# EasyEDA Pro project 基于ESP32的智慧种植小助手2.0_2024-08-18.epro

# Schematic Schematic1
Create Date: 2024-08-18; Page Name: P1; Project Name: 基于ESP32的智慧种植小助手2.0; Schematic Name: Schematic1; Update Date: 2024-08-18; Company: 嘉立创EDA; Page Size: A4; Version: V1.0
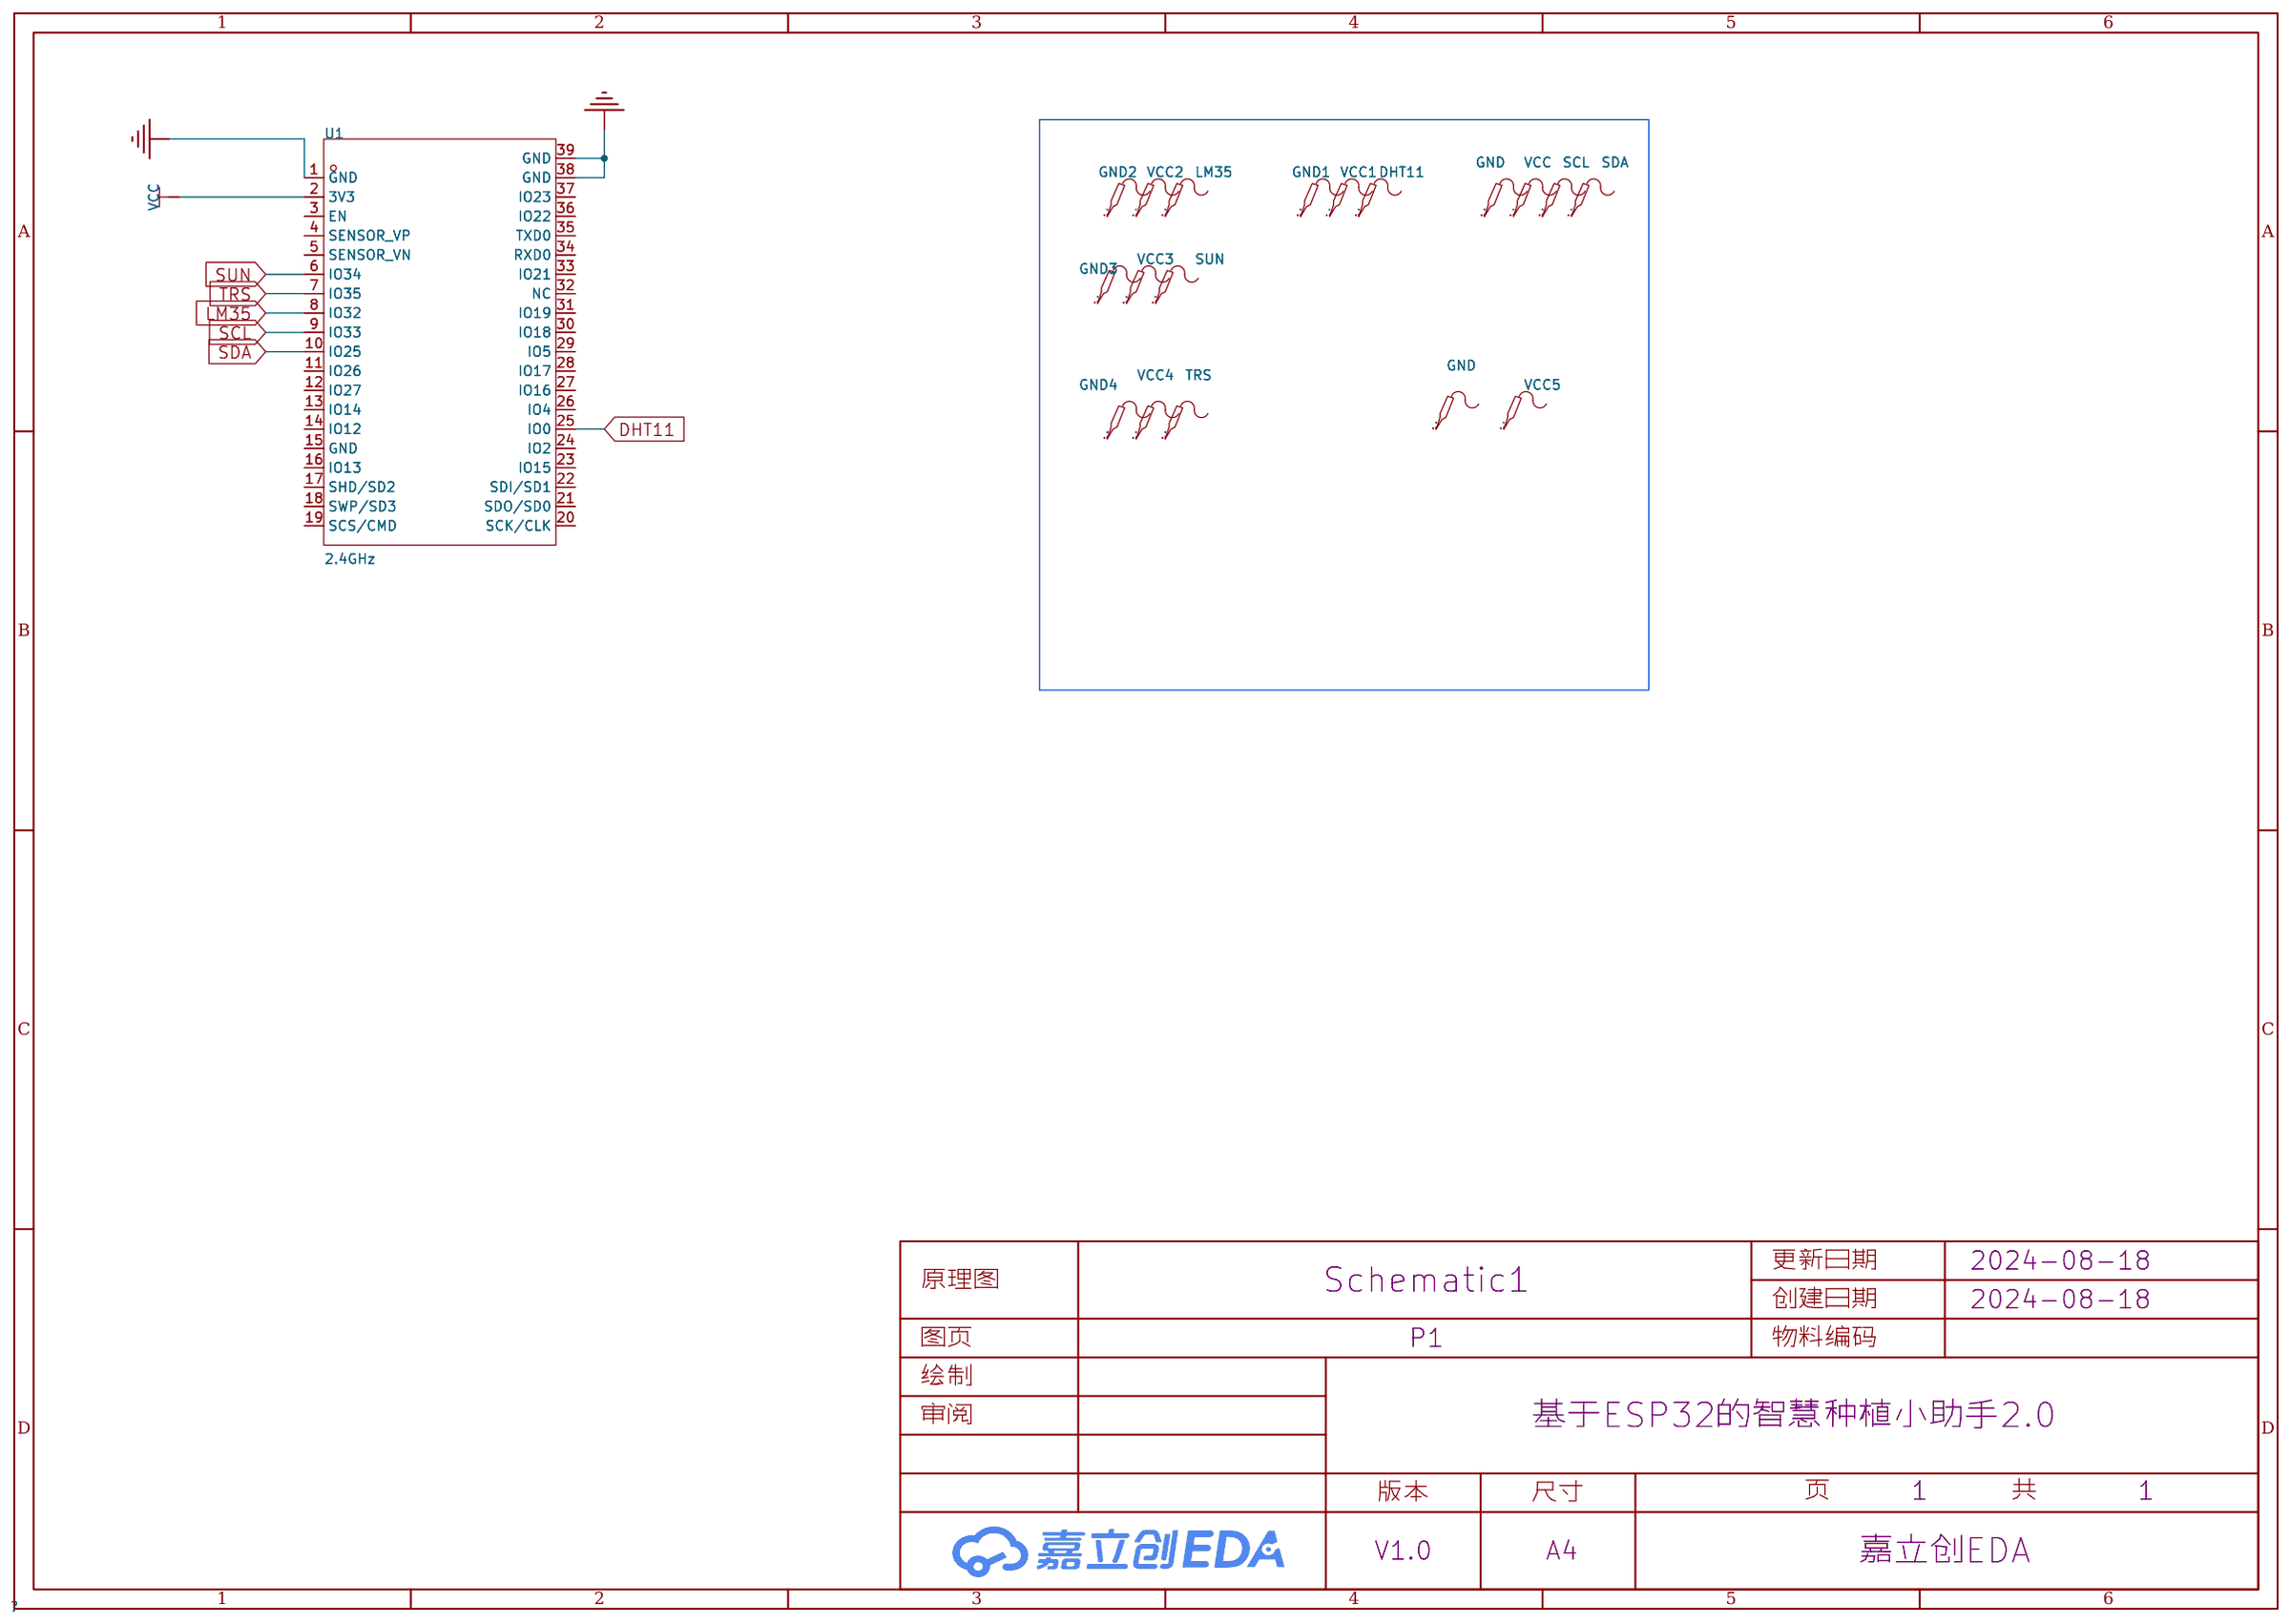
[diagram p0: schematic sheet]

## Parts
DHT11  -  [Test-Point-0.5mm]
GND  -  [Test-Point-0.5mm]
GND1  -  [Test-Point-0.5mm]
GND2  -  [Test-Point-0.5mm]
GND3  -  [Test-Point-0.5mm]
GND4  -  [Test-Point-0.5mm]
LM35  -  [Test-Point-0.5mm]
SCL  -  [Test-Point-0.5mm]
SDA  -  [Test-Point-0.5mm]
SUN  -  [Test-Point-0.5mm]
TP1  GND  [Test-Point-0.5mm]
TRS  -  [Test-Point-0.5mm]
U1  2.4GHz  [WIFIM-SMD_39P-L25.5-W18.0-P1.27]
VCC  -  [Test-Point-0.5mm]
VCC1  -  [Test-Point-0.5mm]
VCC2  -  [Test-Point-0.5mm]
VCC3  -  [Test-Point-0.5mm]
VCC4  -  [Test-Point-0.5mm]
VCC5  -  [Test-Point-0.5mm]

## Library data of the parts
DHT11 GND GND1-GND4 LM35 SCL SDA SUN TP1 TRS VCC VCC1-VCC5 = Test-Point: Test Point 测试点
U1 = ESP32-WROOM-32D(M113DH3200PH3Q0): 核心处理器:ESP32-D0WD芯片;频率:2.4GHz;发射功率:18.5dBm;; Supplier Part: C6244705; Manufacturer: ESPRESSIF(乐鑫); Supplier Footprint: SMD-38P; JLCPCB Part Class: 扩展库; Datasheet: https://atta.szlcsc.com/upload/public/pdf/source/20230606/9D9041236510235E53789CA7484217CB.pdf; Supplier: LCSC; Core Processor: ESP32-D0WD芯片; Support Interface: I2C；GPIO；SPI；JTAG；SDIO；ADC；UART；I2S; Output Power: 18.5dBm

## Nets
GND: U1.1(GND) U1.38(GND) U1.39(GND)
VCC: U1.2(3V3)
DHT11: U1.25(IO0)
LM35: U1.8(IO32)
SCL: U1.9(IO33)
SDA: U1.10(IO25)
SUN: U1.6(IO34)
TRS: U1.7(IO35)

Not connected (* = marked no-connect by the designer): DHT11 1; GND 1; GND1 1; GND2 1; GND3 1; GND4 1; LM35 1; SCL 1; SDA 1; SUN 1; TP1 1; TRS 1; U1 3(EN) 4(SENSOR_VP) 5(SENSOR_VN) 11(IO26) 12(IO27) 13(IO14) 14(IO12) 15(GND) 16(IO13) 17(SHD/SD2) 18(SWP/SD3) 19(SCS/CMD) 20(SCK/CLK) 21(SDO/SD0) 22(SDI/SD1) 23(IO15) 24(IO2) 26(IO4) 27(IO16) 28(IO17) 29(IO5) 30(IO18) 31(IO19) 32(NC) 33(IO21) 34(RXD0) 35(TXD0) 36(IO22) 37(IO23); VCC 1; VCC1 1; VCC2 1; VCC3 1; VCC4 1; VCC5 1

# Board PCB1
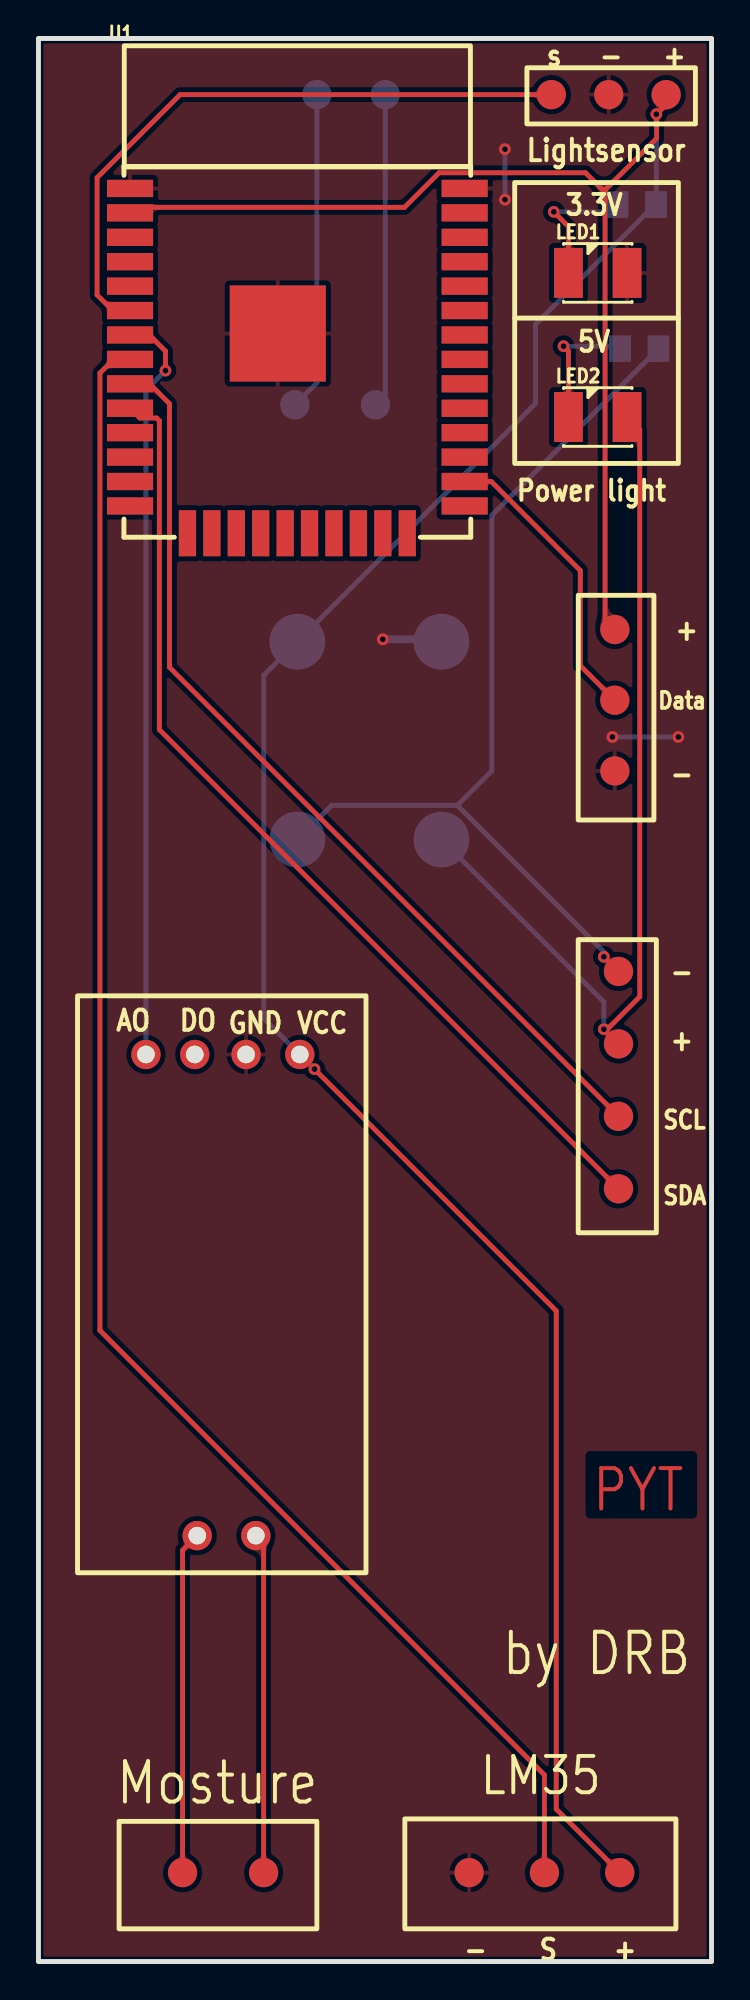
[diagram p1: board, top side]
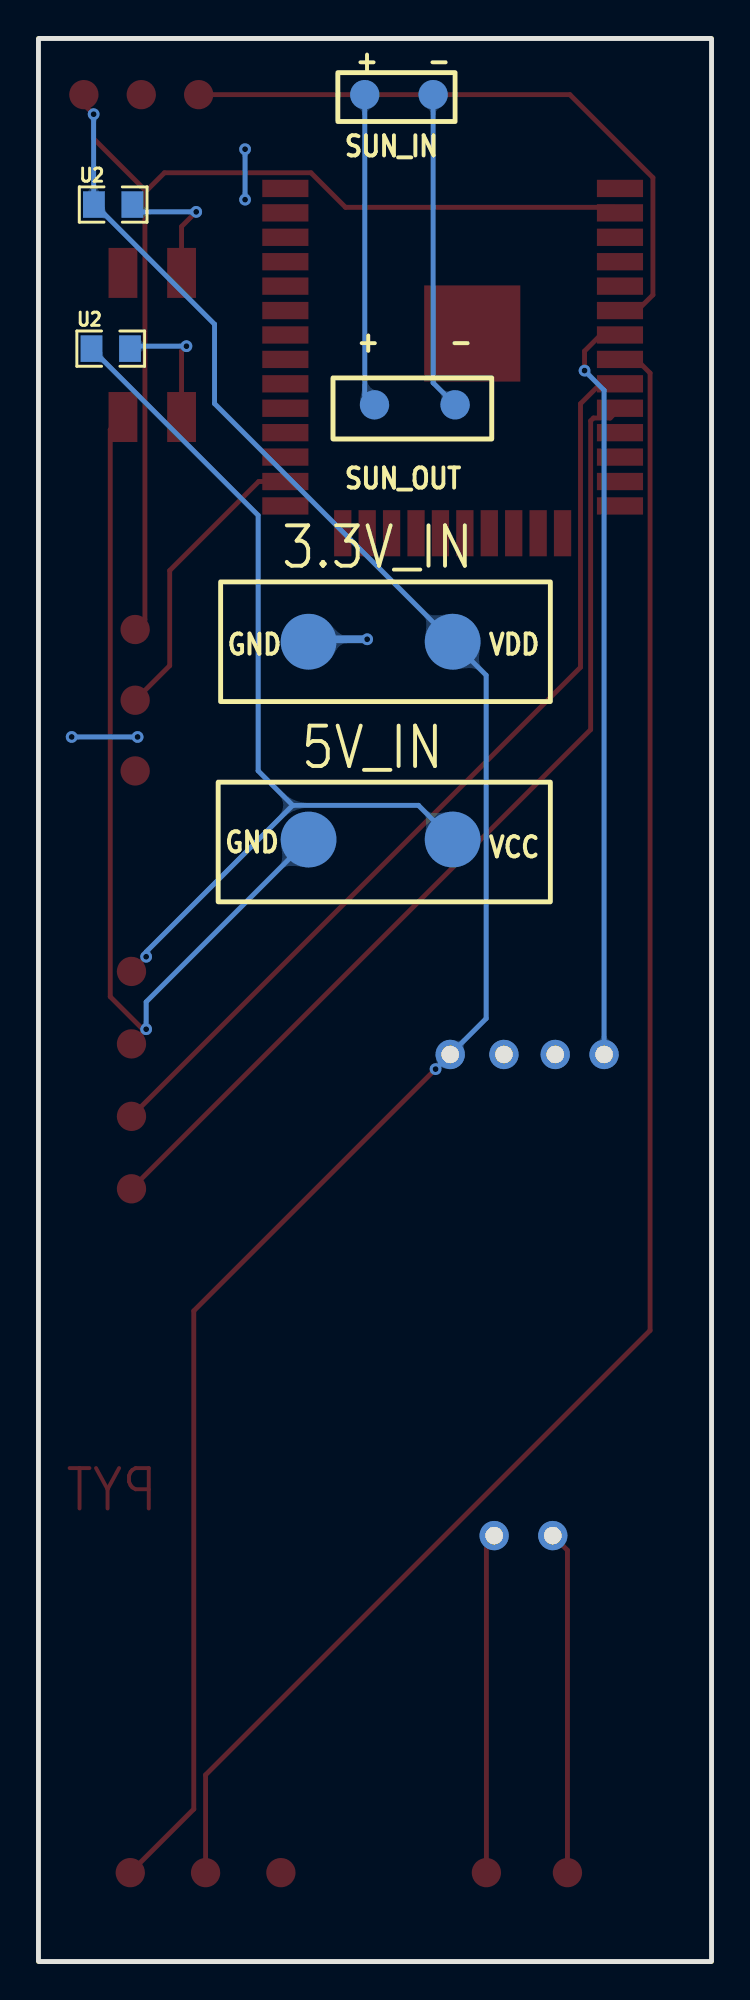
[diagram p2: board, bottom side, seen from below]

Outline 35 x 100 mm; copper layers: Top Layer, Bottom Layer. Coordinates in mm from the lower left corner of the outline.
Outline path: rectangle 0,100 35,0
Stack: Top Layer 0.035mm / Dielectric1 1.51mm FR4 er 4.5 / Bottom Layer 0.035mm

## Design rules (mm)
template: JLCPCB Capability(Two Layers Board)
spacing copperThickness1oz (default): track to track 0.102, other pairs 0.152 to 0.3
spacing copperThickness2oz: track to track 0.203, other pairs 0.152 to 0.3
track width copperThickness1oz (default): min 0.127, default 0.254, max 2.54
track width copperThickness2oz: min 0.203, default 0.254, max 2.54
differential pair differentialPair (default): width min 0.127, default 0.254, max 2.54; gap min 0.152, default 0.152
via viaSize (default): diameter min 0.5, default 0.61, max 10; hole min 0.3, default 0.305, max 6.3

## Placement (name value [footprint] x y rotation side)
LED1  D3528-LED-GREEN  [LED-SMD_L3.5-W2.8-RD_GREEN]  29.08 87.81 0 top
LED2  D3528-LED-GREEN  [LED-SMD_L3.5-W2.8-RD_GREEN]  29.08 80.31 0 top
NOREF  -  [Pad_e88]  30.16 43.95 0 top
NOREF#2  -  [Pad_e75]  8.13 47.17 0 top
NOREF#3  -  [Pad_e242]  13.34 80.95 0 top
NOREF#4  -  [Pad_e89]  30.16 40.18 0 top
NOREF#5  -  [Pad_e63]  11.3 22.15 0 top
NOREF#6  -  [Pad_e23]  26.67 97.08 0 top
NOREF#7  -  [Pad_e109]  13.46 68.63 0 top
NOREF#8  -  [Pad_e84]  29.97 65.59 0 top
NOREF#9  -  [Pad_e118]  20.95 58.34 0 top
NOREF#10  -  [Pad_e110]  20.95 68.63 0 top
NOREF#11  -  [Pad_e49]  11.71 4.62 0 top
NOREF#12  -  [Pad_e86]  30.16 51.49 0 top
NOREF#13  -  [Pad_e47]  26.31 4.62 0 top
NOREF#14  -  [Pad_e38]  18.03 97.08 0 top
NOREF#15  -  [Pad_e50]  7.49 4.62 0 top
NOREF#16  -  [Pad_e87]  30.16 47.72 0 top
NOREF#17  -  [Pad_e25]  32.64 97.08 0 top
NOREF#18  -  [Pad_e37]  14.48 97.08 0 top
NOREF#19  -  [Pad_e243]  17.53 80.95 0 top
NOREF#20  -  [Pad_e117]  13.46 58.34 0 top
NOREF#21  -  [Pad_e76]  5.59 47.17 0 top
NOREF#22  -  [Pad_e48]  22.39 4.62 0 top
NOREF#23  -  [Pad_e74]  10.79 47.17 0 top
NOREF#24  -  [Pad_e85]  29.97 61.91 0 top
NOREF#25  -  [Pad_e24]  29.65 97.08 0 top
NOREF#26  -  [Pad_e73]  13.59 47.17 0 top
NOREF#27  -  [Pad_e46]  30.23 4.62 0 top
NOREF#28  -  [Pad_e62]  8.25 22.15 0 top
NOREF#29  -  [Pad_e83]  29.97 69.27 0 top
U1  2.4GHz  [WIFIM-SMD_39P-L25.5-W18.0-P1.27]  13.46 83.24 0 top
U2  -  [R0805]  31.12 91.36 180 bottom
U2#2  -  [R0805]  31.24 83.87 180 bottom

## Footprints (pads in the part's own frame, mm; a bottom-side part is the same pattern mirrored in y, then rotated)
LED-SMD_L3.5-W2.8-RD_GREEN
  rect 1.5x2.6 smd: 1(-1.524,0) 2(1.524,0)
Pad_e23
  round 1.524 smd: 1(0,0)
Pad_e24
  round 1.524 smd: 40(0,0)
Pad_e25
  round 1.524 smd: 41(0,0)
Pad_e37
  round 1.524 smd far side: 42(0,0)
Pad_e38
  round 1.524 smd far side: 43(0,0)
Pad_e46
  round 1.524 smd: 44(0,0)
Pad_e47
  round 1.524 smd: 45(0,0)
Pad_e48
  round 1.524 smd: 46(0,0)
Pad_e49
  round 1.524 smd: 13(0,0)
Pad_e50
  round 1.524 smd: 48(0,0)
Pad_e62
  round 1.524 hole 0.914: 49(0,0)
Pad_e63
  round 1.524 hole 0.914: 50(0,0)
Pad_e73
  round 1.524 hole 0.914: 50(0,0)
Pad_e74
  round 1.524 hole 0.914: 50(0,0)
Pad_e75
  round 1.524 hole 0.914: 50(0,0)
Pad_e76
  round 1.524 hole 0.914: 50(0,0)
Pad_e83
  round 1.524 smd: 51(0,0)
Pad_e84
  round 1.524 smd: 52(0,0)
Pad_e85
  round 1.524 smd: 53(0,0)
Pad_e86
  round 1.524 smd: 54(0,0)
Pad_e87
  round 1.524 smd: 55(0,0)
Pad_e88
  round 1.524 smd: 56(0,0)
Pad_e89
  round 1.524 smd: 57(0,0)
Pad_e109
  round 2.9 smd far side: 1(0,0)
Pad_e110
  round 2.9 smd far side: 2(0,0)
Pad_e117
  round 2.9 smd far side: 1(0,0)
Pad_e118
  round 2.9 smd far side: 2(0,0)
Pad_e242
  round 1.524 smd far side: 1(0,0)
Pad_e243
  round 1.524 smd far side: 2(0,0)
R0805
  rect 1.133x1.377 smd: 1(-1,0) 2(1,0)
WIFIM-SMD_39P-L25.5-W18.0-P1.27
  rect 2.4x0.9 smd: 1(-8.7,8.965) 2(-8.7,7.695) 3(-8.7,6.425) 4(-8.7,5.155) 5(-8.7,3.885) 6(-8.7,2.615) 7(-8.7,1.345) 8(-8.7,0.075) 9(-8.7,-1.195) 10(-8.7,-2.465) 11(-8.7,-3.735) 12(-8.7,-5.005) 13(-8.7,-6.275) 14(-8.7,-7.545) 25(8.7,-7.545) 26(8.7,-6.275) 27(8.7,-5.005) 28(8.7,-3.735) 29(8.7,-2.465) 30(8.7,-1.195) 31(8.7,0.075) 32(8.7,1.345) 33(8.7,2.615) 34(8.7,3.885) 35(8.7,5.155) 36(8.7,6.425) 37(8.7,7.695) 38(8.7,8.965)
  rect 0.9x2.4 smd: 15(-5.715,-8.965) 16(-4.445,-8.965) 17(-3.175,-8.965) 18(-1.905,-8.965) 19(-0.635,-8.965) 20(0.635,-8.965) 21(1.905,-8.965) 22(3.175,-8.965) 23(4.445,-8.965) 24(5.715,-8.965)
  rect 5x5 smd: 39(-1.017,1.422)

## Nets
GND: LED1.2 NOREF#10.2 NOREF#22.46 NOREF#23.50 NOREF#24.53 NOREF#25.40 U1.1 U1.38 U1.39
GNDD: LED2.2 NOREF#9.2 NOREF#16.55
VCC: NOREF#12.54 NOREF#20.1 U2#2.1
VDD: NOREF#7.1 NOREF#17.41 NOREF#26.50 NOREF#27.44 NOREF#29.51 U1.2 U2.1
12: NOREF#15.48 NOREF#28.49
13: NOREF#5.50 NOREF#11.13
DHT11: NOREF#8.52 U1.26
LM35: NOREF#13.45 U1.8
SCL: NOREF.56 U1.9
SDA: NOREF#4.57 U1.10
SUN: NOREF#6.1 U1.6
SUN+: NOREF#14.43 NOREF#19.2
SUN-: NOREF#3.1 NOREF#18.42
TRS: NOREF#21.50 U1.7

Pads without a net: LED1 1; LED2 1; NOREF#2 50; U1 3 4 5 11 12 13 14 15 16 17 18 19 20 21 22 23 24 25 27 28 29 30 31 32 33 34 35 36 37; U2 2; U2#2 2

## Via types
v1: diameter 0.61, hole 0.305, Top Layer to Bottom Layer, 12 vias

## Routing (per net, layer and track width the routed paths; a pad name or vN(x,y) marks a point on that pad's centre or on a via; arc(x,y) is an arc through that point)
GND: length 9.2
  Bottom Layer w0.254: v1(24.26,94.24) v1(24.26,91.62) ; v1(29.84,63.68) v1(33.27,63.68)
  Bottom Layer w0.4: v1(17.91,68.76) 20.83,68.76 NOREF#10.2
GNDD: length 47.4
  Top Layer w0.254: 29.49,48.39 31.27,50.17 31.27,79.65 LED2.2 ; 29.49,48.39 v1(29.4,48.48) ; 29.49,48.39 NOREF#16.55
  Bottom Layer w0.254: v1(29.4,48.48) 29.4,49.9 NOREF#9.2
VCC: length 49.2
  Top Layer w0.254: NOREF#12.54 v1(29.4,52.25)
  Bottom Layer w0.254: U2#2.1 23.58,75.21 23.58,61.92 21.78,60.12 ; NOREF#20.1 15.24,60.12 21.78,60.12 ; 21.78,60.12 29.4,52.5 v1(29.4,52.25)
VDD: length 163
  Top Layer w0.254: NOREF#27.44 26.92,7.93 26.92,33.83 v1(14.35,46.41) ; NOREF#17.41 32.64,96.57 32.14,96.08 ; NOREF#29.51 29.46,69.77 29.46,92 ; 29.46,92 28.45,93.01 20.83,93.01 19.03,91.22 5.05,91.22 4.76,90.93 ; 29.46,92 29.46,92.13 32.14,94.81 32.14,96.08 ; 32.14,96.08 v1(32.13,96.06)
  Bottom Layer w0.254: 32.13,91.43 25.84,85.14 25.84,81.01 NOREF#7.1 11.72,66.89 11.72,49.04 NOREF#26.50 v1(14.35,46.41) ; 32.13,91.43 32.13,91.38 U2.1 ; 32.13,91.43 v1(32.13,96.06)
(no net): length 13.7
  Top Layer w0.254: v1(27.31,84) 27.56,83.74 LED2.1 ; LED1.1 27.56,90.22 v1(26.8,90.98)
  Bottom Layer w0.254: U2.2 29.73,90.98 v1(26.8,90.98) ; v1(27.31,84) 30.12,84 U2#2.2
12: length 17.8
  Top Layer w0.254: NOREF#15.48 7.49,21.39 NOREF#28.49
13: length 17.7
  Top Layer w0.254: NOREF#5.50 11.71,21.74 NOREF#11.13
DHT11: length 15.4
  Top Layer w0.254: 22.16,76.96 23.55,76.96 28.18,72.33 28.18,67.38 NOREF#8.52
LM35: length 89.4
  Top Layer w0.254: U1.8 3.91,83.31 3.2,82.6 3.2,32.82 26.31,9.7 NOREF#13.45
SCL: length 49.2
  Top Layer w0.254: NOREF.56 6.81,67.3 6.81,81.01 5.92,81.9 4.9,81.9 U1.9
SDA: length 51.6
  Top Layer w0.254: NOREF#4.57 6.29,64.06 6.29,80.12 6.14,80.26 5.27,80.26 U1.10
SUN: length 33.6
  Top Layer w0.254: NOREF#6.1 7.37,97.08 3.05,92.76 3.05,86.66 3.86,85.85 4.76,85.85
SUN+: length 16.3
  Bottom Layer w0.254: NOREF#19.2 18.03,81.46 NOREF#14.43
SUN-: length 16.6
  Bottom Layer w0.254: NOREF#18.42 14.48,82.09 NOREF#3.1
TRS: length 39.2
  Top Layer w0.254: v1(6.6,82.73) 6.6,83.74 5.77,84.58 U1.7
  Bottom Layer w0.254: v1(6.6,82.73) 5.59,81.71 NOREF#21.50

## Copper pours and planes (outline as drawn; the poured copper is in the pictures)
GND on Top Layer: -7.35,106.58 40.14,106.58 40.14,-3.78 -7.35,-3.78

Small or netless copper shapes (teardrops, artwork), in the pictures only: 33 on Top Layer, 30 on Bottom Layer

## Text on the board
Bottom Silkscreen Layer: VDD | VCC | - | + | SUN_IN | SUN_OUT | GND | 5V_IN | 3.3V_IN
Top Layer: PYT
Top Silkscreen Layer: Data | SCL | SDA | AO | DO | GND | VCC | - | Power light | S | s | 3.3V | 5V | + | Lightsensor | LM35 | Mosture | by DRB
